# Altium schematic sheet pixhawk2.4.9.SchDoc
size 762 x 1016 mm
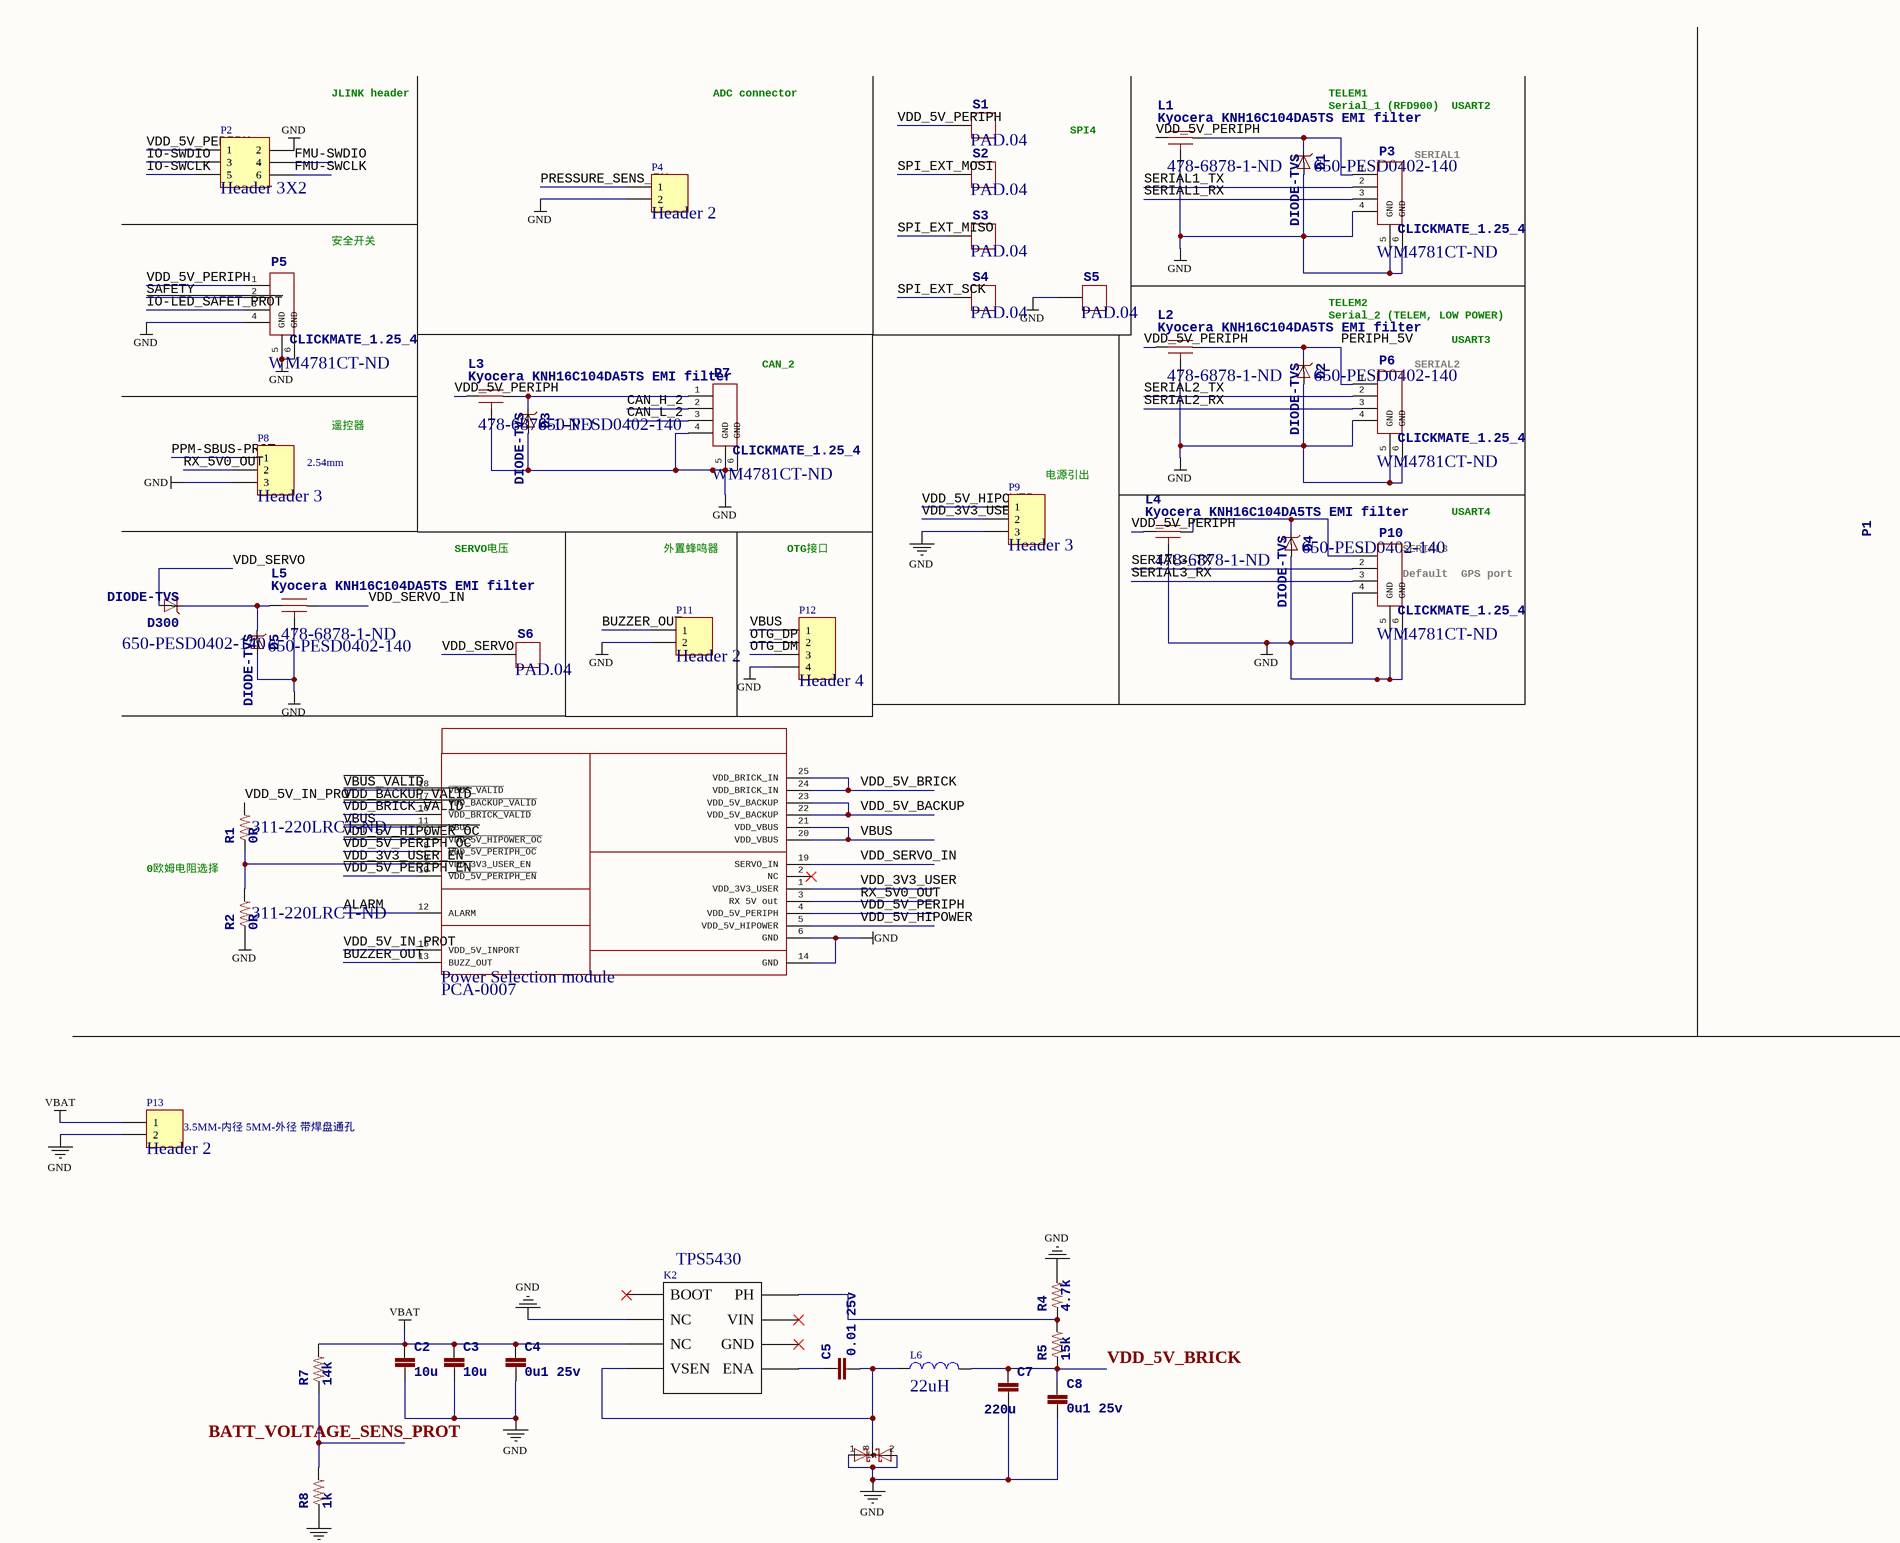
[diagram p0: pixhawk2.4.9.SchDoc, top left]
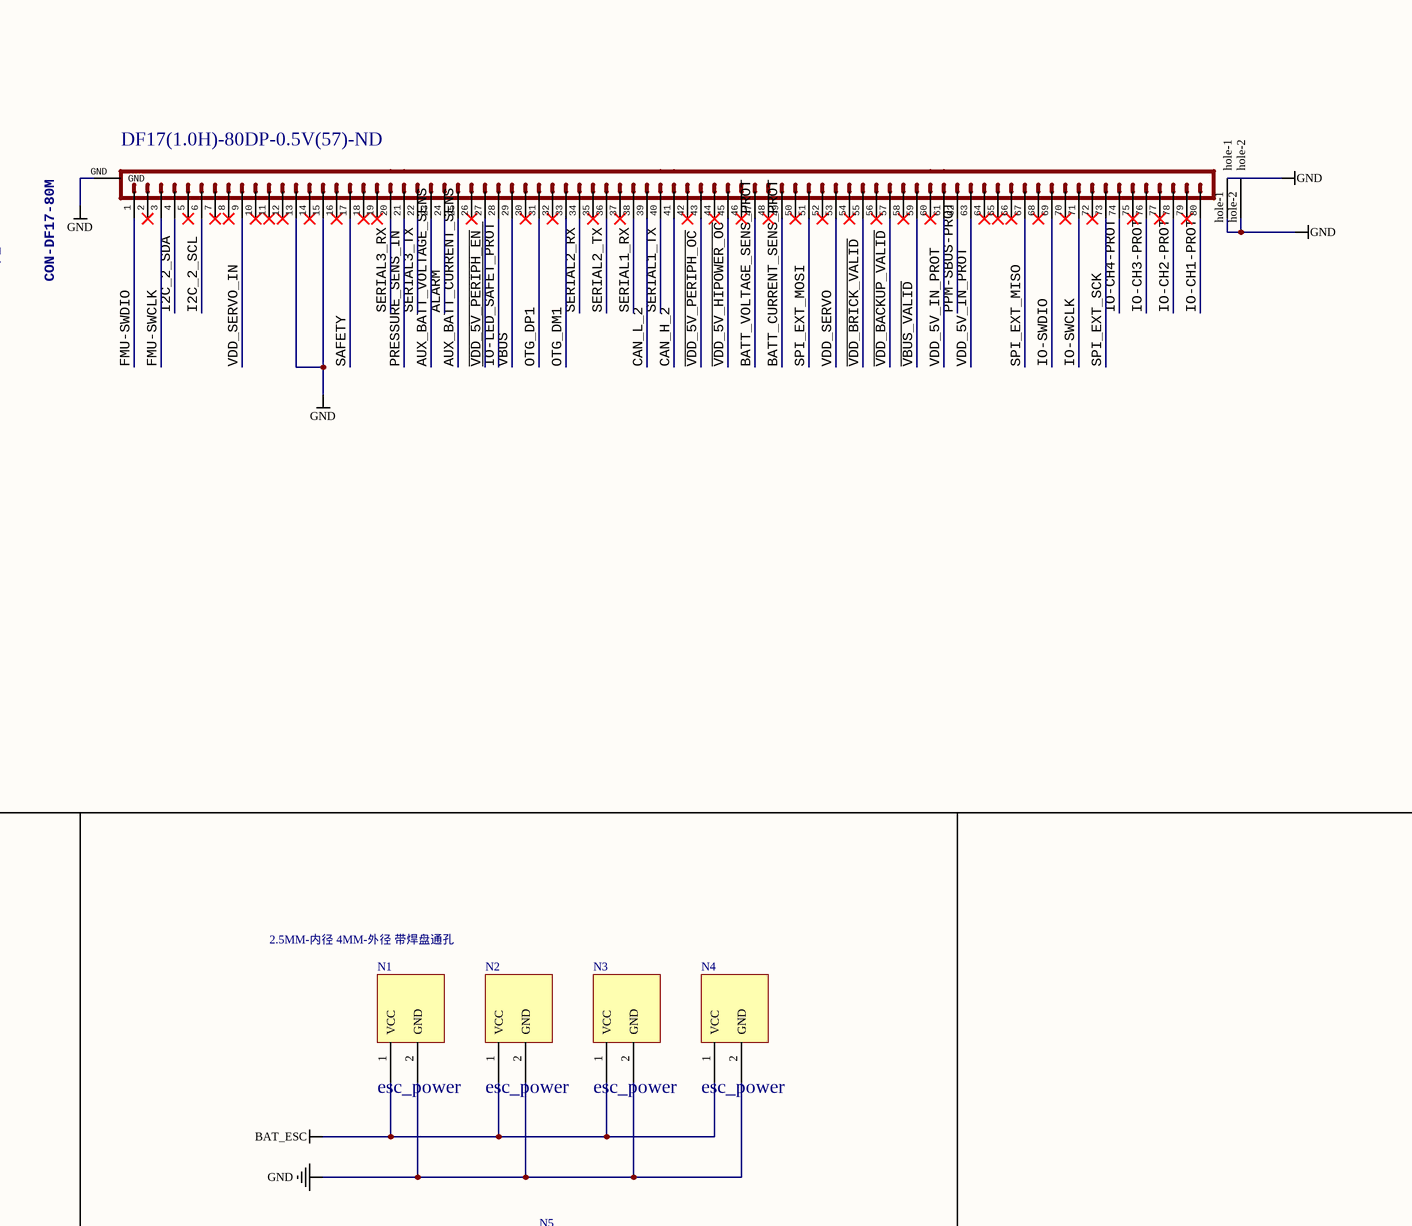
[diagram p1: pixhawk2.4.9.SchDoc, top right]
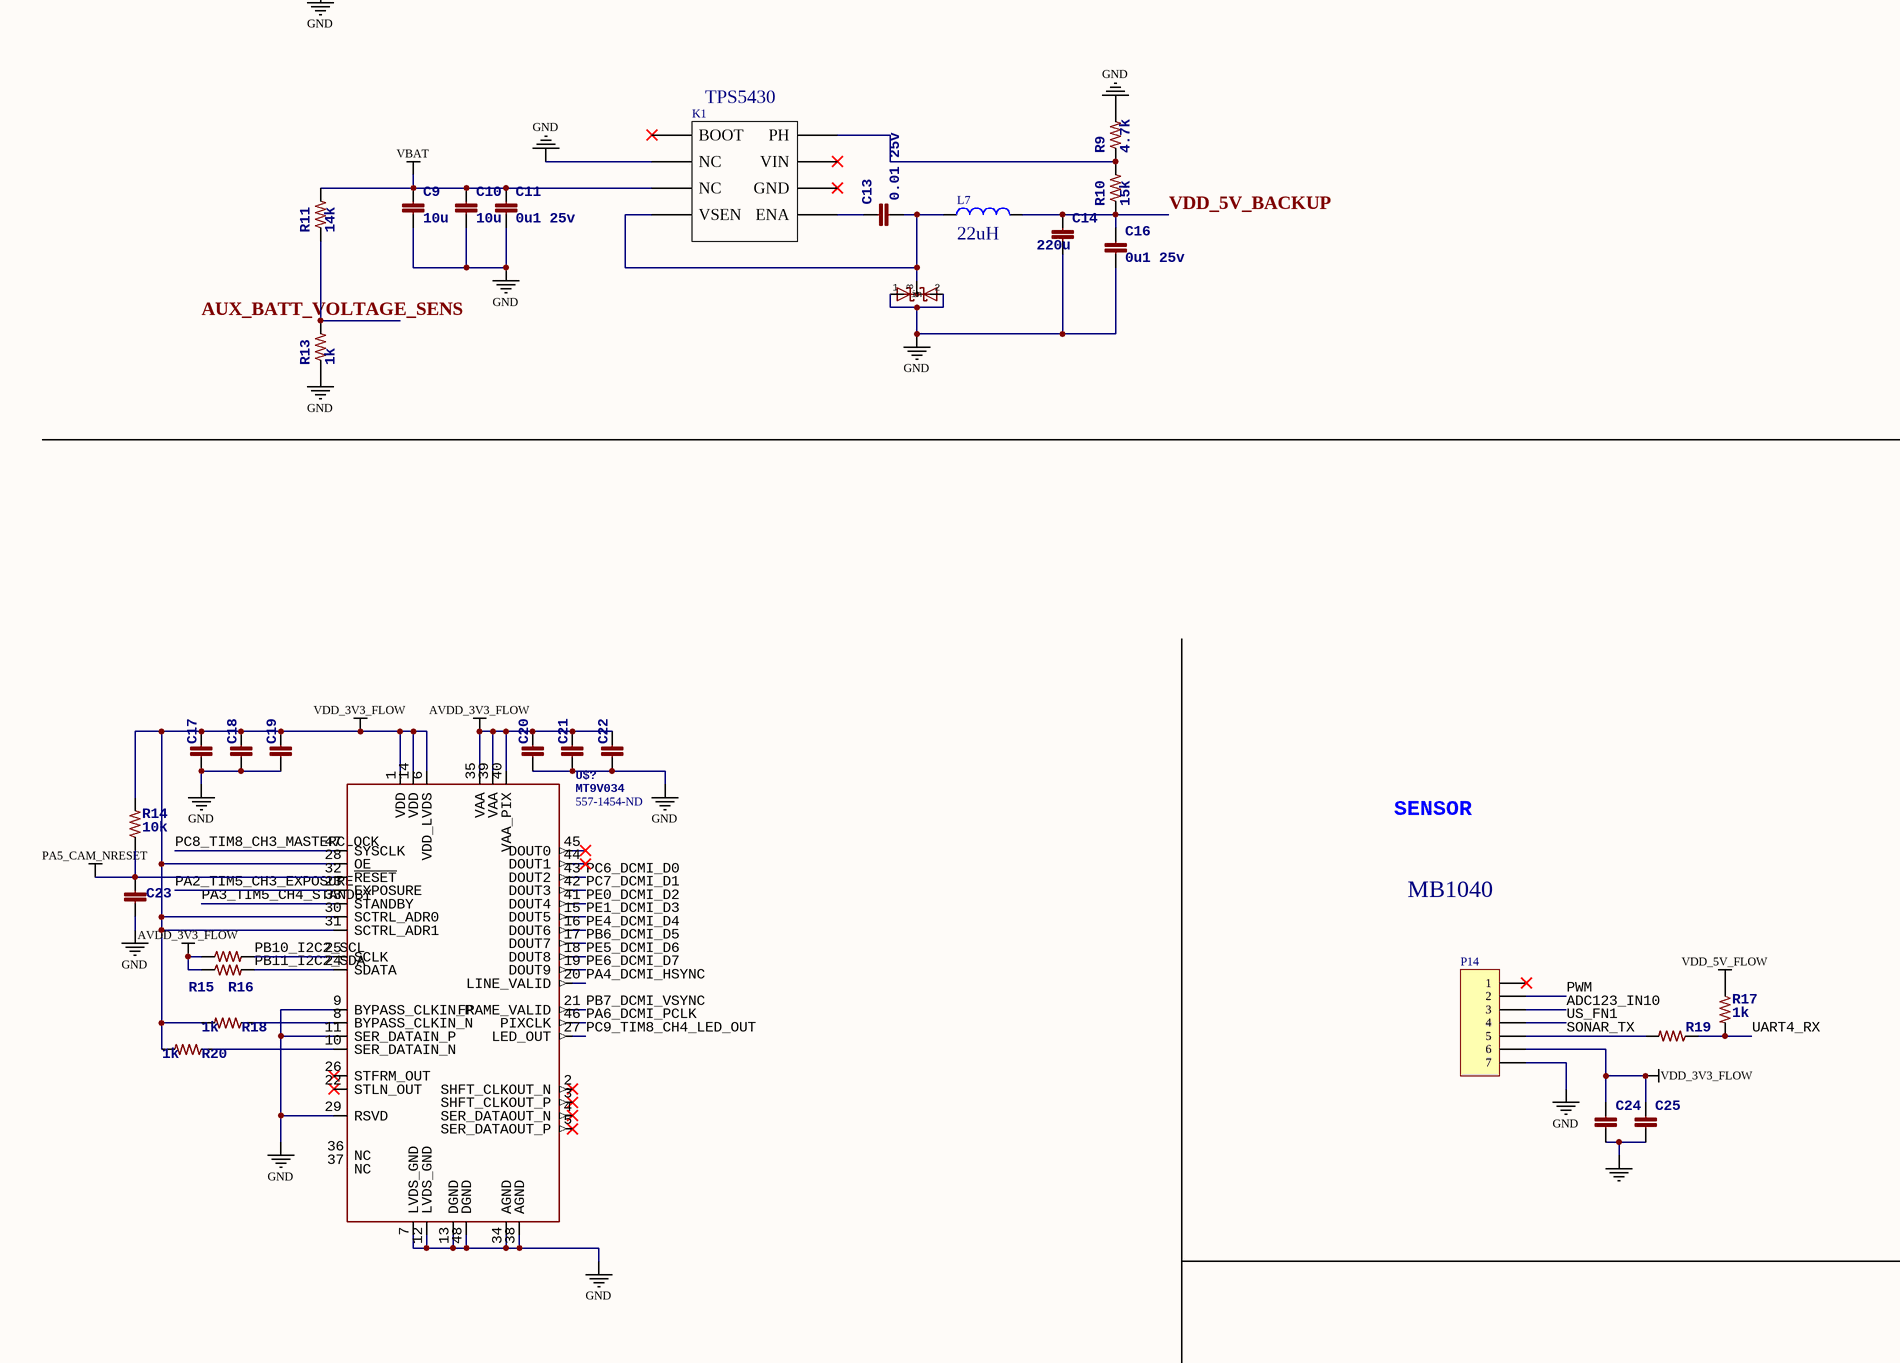
[diagram p2: pixhawk2.4.9.SchDoc, centre left]
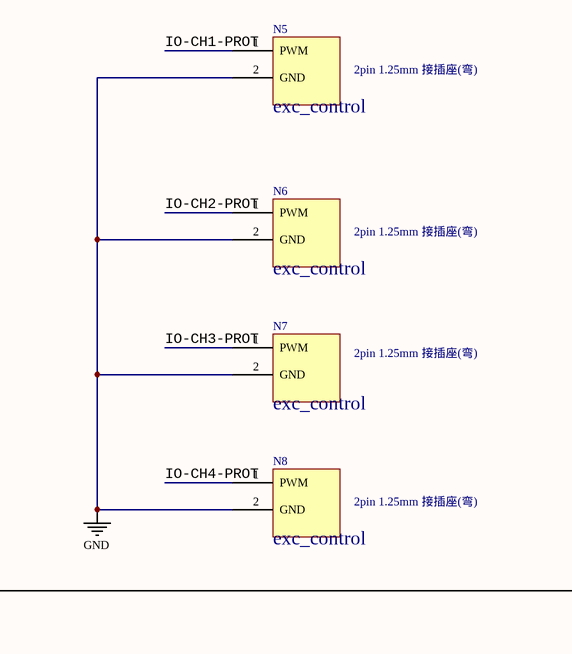
[diagram p3: pixhawk2.4.9.SchDoc, centre right]
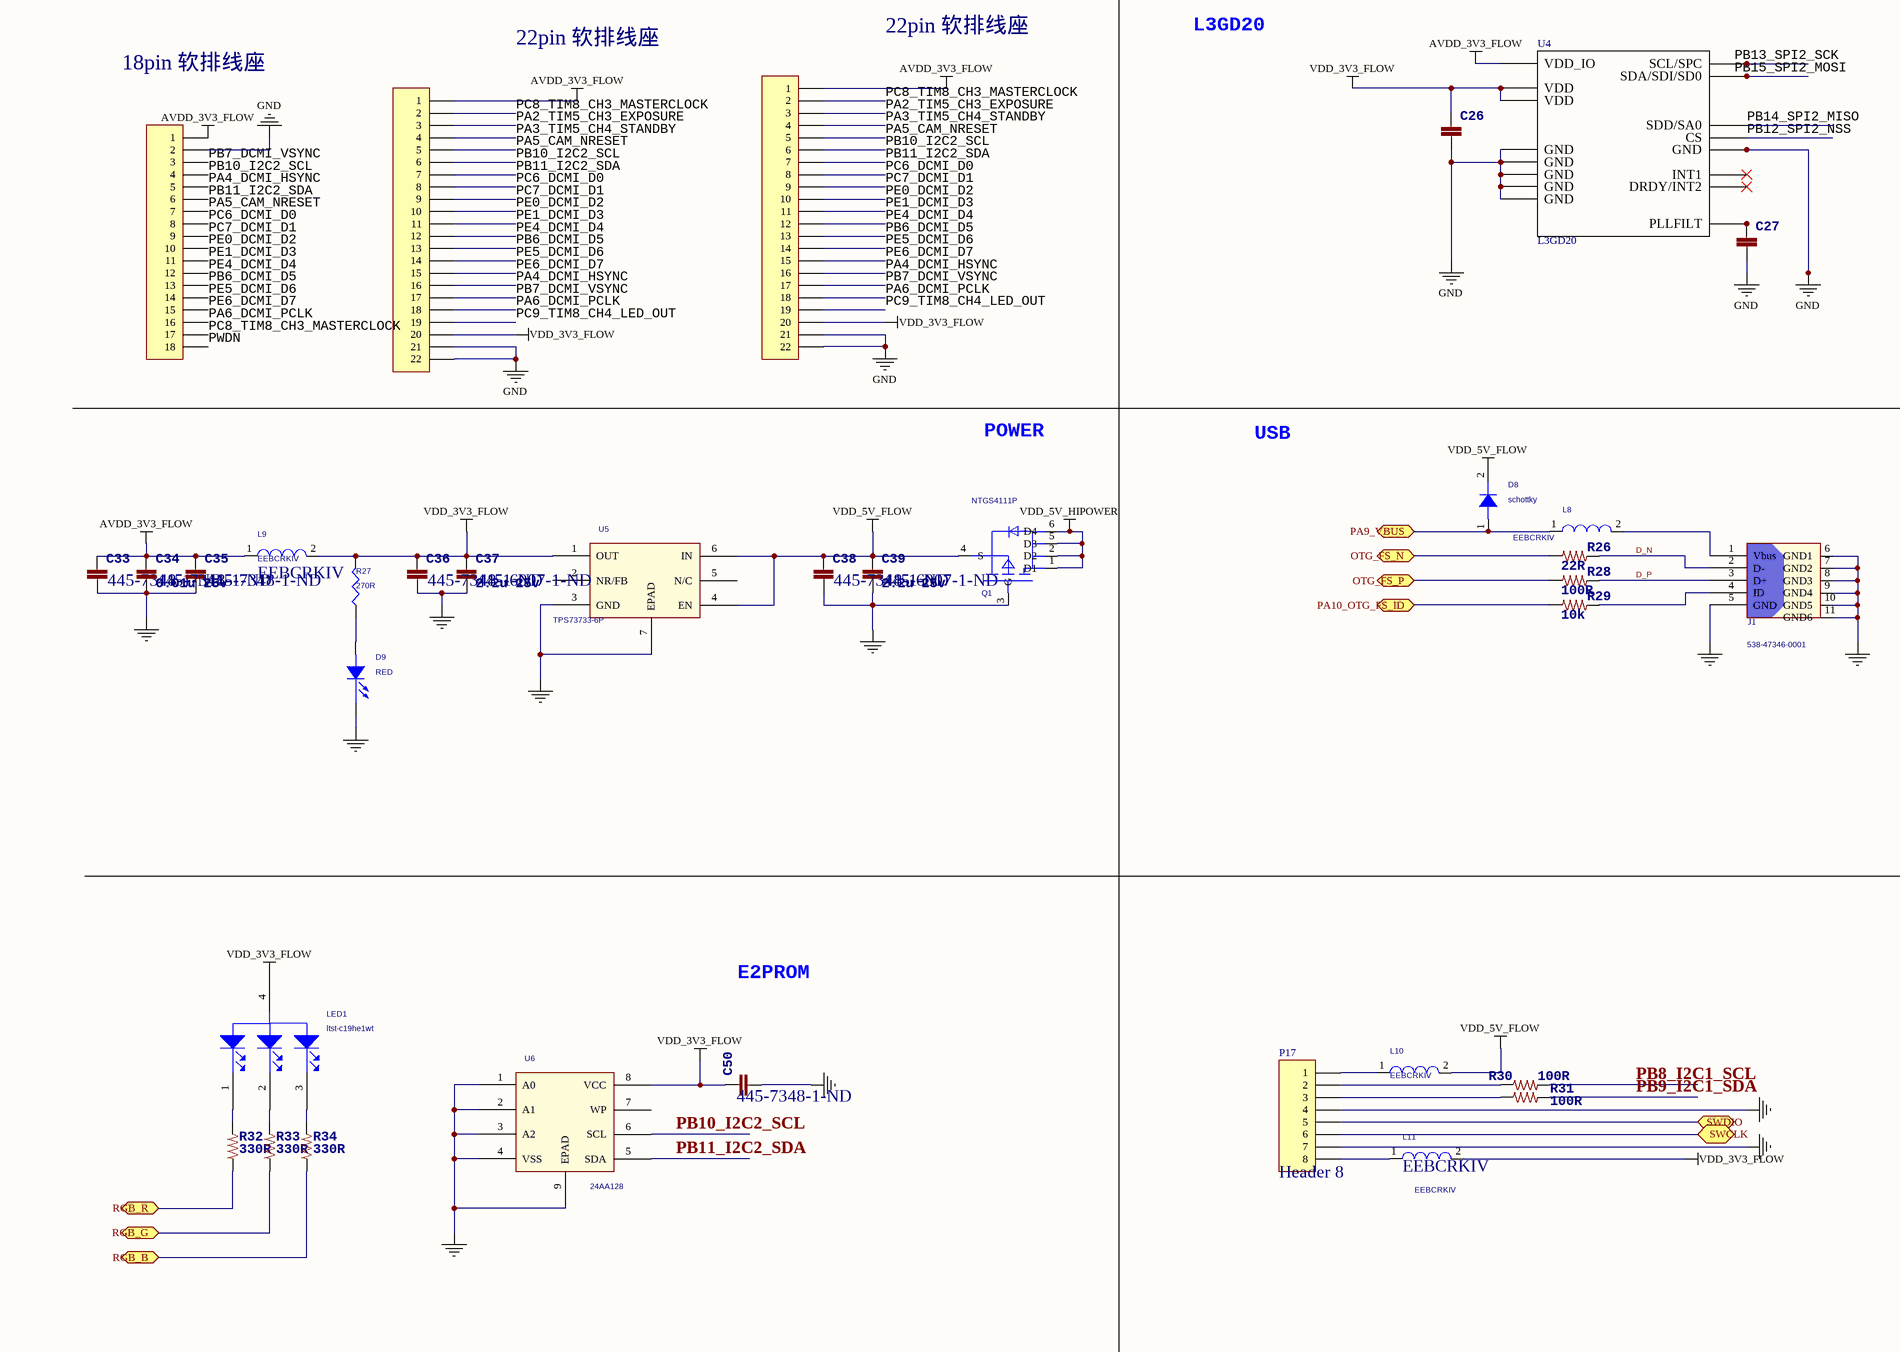
[diagram p4: pixhawk2.4.9.SchDoc, bottom left]
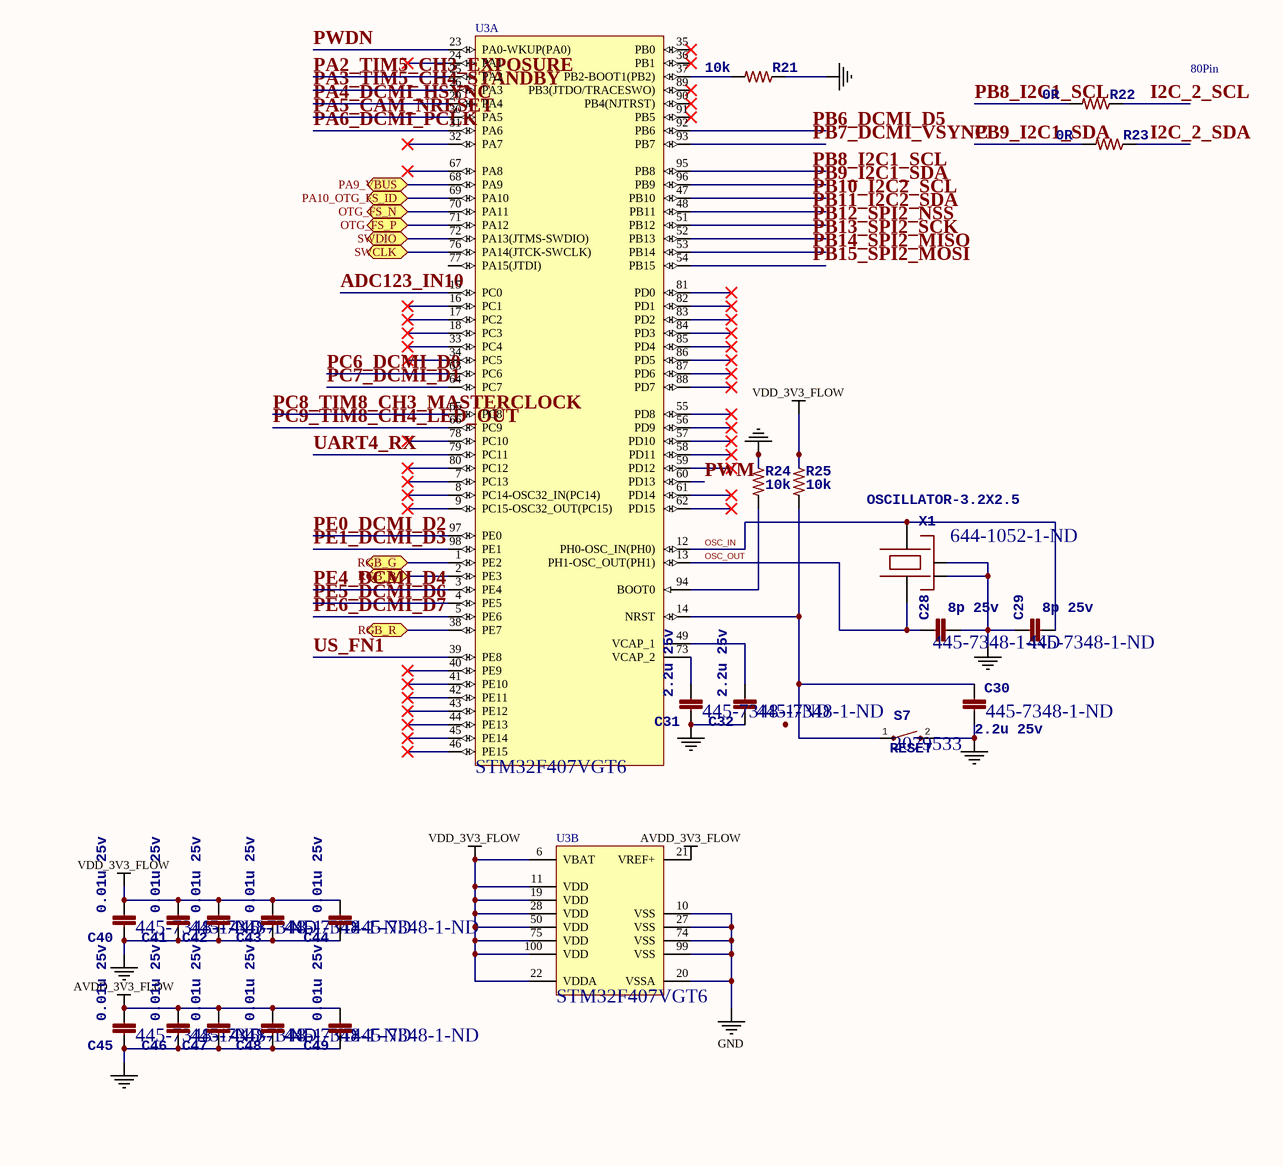
[diagram p5: pixhawk2.4.9.SchDoc, bottom right]

## Parts
C2  10u  [C1206]
C3  10u  [C1206]
C4  0u1 25v  [C0402]
C5  0.01 25v  [C0402]
C7  220u  [C1206]
C8  0u1 25v  [C0402]
C9  10u  [C1206]
C10  10u  [C1206]
C11  0u1 25v  [C0402]
C13  0.01 25v  [C0402]
C14  220u  [C1206]
C16  0u1 25v  [C0402]
C17  (no value)  [C0402]
C18  (no value)  [C0402]
C19  (no value)  [C0402]
C20  0.1u 25v  [C0402]  (value not drawn)
C21  (no value)  [C0402]
C22  (no value)  [C0402]
C23  (no value)  [C0402]
C24  0.01u 25v  [C0402]  (value not drawn)
C25  2.2u 25v  [C0402]  (value not drawn)
C26  (no value)  [C0402]
C27  0.01u 25v  [C0402]  (value not drawn)
C28  8p 25v  Supplier Part Number 1: 445-7348-1-ND  [C0402]
C29  8p 25v  Supplier Part Number 1: 445-7348-1-ND  [C0402]
C30  2.2u 25v  Supplier Part Number 1: 445-7348-1-ND  [C0402]
C31  2.2u 25v  Supplier Part Number 1: 445-7348-1-ND  [C0402]
C32  2.2u 25v  Supplier Part Number 1: 445-7348-1-ND  [C0402]
C33  Supplier Part Number 1: 445-7348-1-ND  [C0402]
C34  0.01u 25v  Supplier Part Number 1: 445-7348-1-ND  [C0402]
C35  Supplier Part Number 1: 445-7348-1-ND  [C0402]
C36  Supplier Part Number 1: 445-7348-1-ND  [C0402]
C37  2.2u 25v  Supplier Part Number 1: 445-6007-1-ND  [C1206]
C38  Supplier Part Number 1: 445-7348-1-ND  [C0402]
C39  2.2u 25v  Supplier Part Number 1: 445-6007-1-ND  [C1206]
C40  0.01u 25v  Supplier Part Number 1: 445-7348-1-ND  [C0402]
C41  0.01u 25v  Supplier Part Number 1: 445-7348-1-ND  [C0402]
C42  0.01u 25v  Supplier Part Number 1: 445-7348-1-ND  [C0402]
C43  0.01u 25v  Supplier Part Number 1: 445-7348-1-ND  [C0402]
C44  0.01u 25v  Supplier Part Number 1: 445-7348-1-ND  [C0402]
C45  0.01u 25v  Supplier Part Number 1: 445-7348-1-ND  [C0402]
C46  0.01u 25v  Supplier Part Number 1: 445-7348-1-ND  [C0402]
C47  0.01u 25v  Supplier Part Number 1: 445-7348-1-ND  [C0402]
C48  0.01u 25v  Supplier Part Number 1: 445-7348-1-ND  [C0402]
C49  0.01u 25v  Supplier Part Number 1: 445-7348-1-ND  [C0402]
C50  Supplier Part Number 1: 445-7348-1-ND  [C0402]
D1  DIODE-TVS  Supplier Part Number 1: 650-PESD0402-140  [0402-TVS]
D2  DIODE-TVS  Supplier Part Number 1: 650-PESD0402-140  [0402-TVS]
D3  DIODE-TVS  Supplier Part Number 1: 650-PESD0402-140  [0402-TVS]
D4  DIODE-TVS  Supplier Part Number 1: 650-PESD0402-140  [0402-TVS]
D5  DIODE-TVS  Supplier Part Number 1: 650-PESD0402-140  [0402-TVS]
D8  schottky  [D0603]
D9  RED  [LED0402]
D300  DIODE-TVS  Supplier Part Number 1: 650-PESD0402-140  [0402-TVS]
Da  (no value)  [TO-277A]
Db  (no value)  [TO-277A]
J1  Mouser Part Number: 538-47346-0001  [usbmicro_b]  (hidden comment: miniUSB)
K1  TPS5430
K2  TPS5430
L1  Kyocera KNH16C104DA5TS EMI filter  Supplier Part Number 1: 478-6878-1-ND  [KYOCERA-KNH16-DA]
L2  Kyocera KNH16C104DA5TS EMI filter  Supplier Part Number 1: 478-6878-1-ND  [KYOCERA-KNH16-DA]
L3  Kyocera KNH16C104DA5TS EMI filter  Supplier Part Number 1: 478-6878-1-ND  [KYOCERA-KNH16-DA]
L4  Kyocera KNH16C104DA5TS EMI filter  Supplier Part Number 1: 478-6878-1-ND  [KYOCERA-KNH16-DA]
L5  Kyocera KNH16C104DA5TS EMI filter  Supplier Part Number 1: 478-6878-1-ND  [KYOCERA-KNH16-DA]
L6  value 22uH  [CKCD5D28]  (hidden comment: Inductor)
L7  value 22uH  [CKCD5D28]  (hidden comment: Inductor)
L8  EEBCRKIV  [L0603]
L9  EEBCRKIV  [L0603]
L10  EEBCRKIV  [L0603]
L11  EEBCRKIV  [L0603]
LED1  ltst-c19he1wt  [ltst-c19he1wt]
N1  esc_power
N2  esc_power
N3  esc_power
N4  esc_power
N5  exc_control
N6  exc_control
N7  exc_control
N8  exc_control
P1  CON-DF17-80M  Supplier Part Number 1: DF17(1.0H)-80DP-0.5V(57)-ND  [CON-DF17-80M]
P2  Header 3X2  [HDR2X3]
P3  CLICKMATE_1.25_4  Supplier Part Number 1: WM4781CT-ND  [CLICKMATE_V4]
P4  Header 2  [HDR1X2]
P5  CLICKMATE_1.25_4  Supplier Part Number 1: WM4781CT-ND  [CLICKMATE_V4]
P6  CLICKMATE_1.25_4  Supplier Part Number 1: WM4781CT-ND  [CLICKMATE_V4]
P7  CLICKMATE_1.25_4  Supplier Part Number 1: WM4781CT-ND  [CLICKMATE_V4]
P8  Header 3  [HDR1X3]
P9  Header 3  [HDR1X3]
P10  CLICKMATE_1.25_4  Supplier Part Number 1: WM4781CT-ND  [CLICKMATE_V4]
P11  Header 2  [HDR1X2]
P12  Header 4  [HDR1X4]
P13  Header 2  [VBAT-JACK]
P14  Header 7  [HDR1X7]  (value not drawn)
P15  Header 18  [FPC-18_0P5]  (value not drawn)
P16  Header 22  [FPC-22_0P5]  (value not drawn)
P17  Header 8  [HDR1X8]
P18  Header 22  [FPC-22_0P5]  (value not drawn)
PSM1  Power Selection module  Supplier Part Number 1: PCA-0007  [PSM]
Q1  NTGS4111P  [TSOP-6]
R1  0R  Supplier Part Number 1: 311-220LRCT-ND  [R0402]
R2  0R  Supplier Part Number 1: 311-220LRCT-ND  [R0402]
R4  4.7k  [R0402]
R5  15k  [R0402]
R7  14k  [R0402]
R8  1k  [R0402]
R9  4.7k  [R0402]
R10  15k  [R0402]
R11  14k  [R0402]
R13  1k  [R0402]
R14  10k  [R0402]
R15  330R  [R0402]  (value not drawn)
R16  330R  [R0402]  (value not drawn)
R17  1k  [R0402]
R18  1k  [R0402]
R19  0R  [R0402]  (value not drawn)
R20  1k  [R0402]
R21  10k  [R0402]
R22  0R  [R0402]
R23  0R  [R0402]
R24  10k  [R0402]
R25  10k  [R0402]
R26  22R  [R0402]
R27  270R  [R0201]
R28  100R  [R0402]
R29  10k  [R0402]
R30  100R  [R0402]
R31  100R  [R0402]
R32  330R  [R0402]
R33  330R  [R0402]
R34  330R  [R0402]
S1  PAD.04  [PAD_04X04]
S2  PAD.04  [PAD_04X04]
S3  PAD.04  [PAD_04X04]
S4  PAD.04  [PAD_04X04]
S5  PAD.04  [PAD_04X04]
S6  PAD.04  [PAD_04X04]
S7  RESET  Supplier Part Number 1: 2079533  [EVQP7J01K]
U3  STM32F407VGT6  [STM-LQFP100_N]  (parts A,B of 2)
U4  L3GD20
U5  TPS73733-6P  [S-PDSO-N6]
U6  24AA128  [TDFN-8]
U$?  MT9V034  Supplier Part Number 1: 557-1454-ND  [CLCC-48]
X1  OSCILLATOR-3.2X2.5  Supplier Part Number 1: 644-1052-1-ND  [3225SA]

## Ports
OTG_FS_N (bidir), OTG_FS_P (bidir), PA9_VBUS (bidir), PA10_OTG_FS_ID (bidir), RGB_B (bidir), RGB_G (bidir), RGB_R (bidir), SWCLK (bidir), SWDIO (bidir)

## Nets
AVDD_3V3_FLOW: C20.1 C21.1 C22.1 C33.P$1 C34.P$1 C35.P$1 C45.P$2 C46.P$2 C47.P$2 C48.P$2 C49.P$2 L9.1 P15.1 P16.1 P18.1 R15.1 R16.1 U3.21(VREF+) U4.1(VDD_IO) U$?.35(VAA) U$?.39(VAA) U$?.40(VAA_PIX)
BAT_ESC: N1.1(VCC) N2.1(VCC) N3.1(VCC) N4.1(VCC)
GND: C2.P$2 C3.P$2 C4.P$2 C7.P$2 C8.P$2 C9.P$2 C10.P$2 C11.P$2 C14.P$2 C16.P$2 C17.2 C18.2 C19.2 C20.2 C21.2 C22.2 C23.2 C24.P$2 C25.P$2 C26.P$2 C27.P$2 C28.P$2 C29.P$1 C30.P$2 C31.P$1 C32.P$1 C33.P$2 C34.P$2 C35.P$2 C36.P$2 C37.P$2 C38.P$2 C39.P$2 C40.P$1 C41.P$1 C42.P$1 C43.P$1 C44.P$1 C45.P$1 C46.P$1 C47.P$1 C48.P$1 C49.P$1 C50.P$2 D1.A D2.A D3.A D4.A D5.A D9.2(CATHODE) Da.1(in) Da.2(in) Db.1(in) Db.2(in) J1.5(GND) J1.6(GND1) J1.7(GND2) J1.8(GND3) J1.9(GND4) J1.10(GND5) J1.11(GND6) K1.2(NC) K2.2(NC) L1.GND L2.GND L3.GND L4.GND L5.GND N1.2(GND) N2.2(GND) N3.2(GND) N4.2(GND) N5.2(GND) N6.2(GND) N7.2(GND) N8.2(GND) P1.13 P1.15 P1.GND P1.hole-1 P1.hole-2 P2.2 P3.4 P3.5(GND) P3.6(GND) P4.2 P5.4 P5.5(GND) P5.6(GND) P6.4 P6.5(GND) P6.6(GND) P7.4 P7.5(GND) P7.6(GND) P8.3 P9.3 P10.4 P10.5(GND) P10.6(GND) P11.2 P12.4 P13.2 P14.7 P15.2 P16.21 P16.22 P17.4 P17.7 P18.21 P18.22 PSM1.6(GND) PSM1.14(GND) Q1.3(G) R2.P$1 R4.P$2 R8.P$1 R9.P$2 R13.P$1 R21.1 R24.1 S5.P$1 S7.2 U3.10(VSS) U3.20(VSSA) U3.27(VSS) U3.74(VSS) U3.99(VSS) U4.8(GND) U4.9(GND) U4.10(GND) U4.11(GND) U4.12(GND) U4.13(GND) U5.3(GND) U5.7(EPAD) U6.1(A0) U6.2(A1) U6.3(A2) U6.4(VSS) U6.9(EPAD) U$?.7(LVDS_GND) U$?.9(BYPASS_CLKIN_P) U$?.11(SER_DATAIN_P) U$?.12(LVDS_GND) U$?.13(DGND) U$?.29(RSVD) U$?.34(AGND) U$?.38(AGND) U$?.48(DGND) X1.2(NC_2) X1.4(NC_4)
PA5_CAM_NRESET: C23.1 P15.7 P16.5 P18.5 R14.1 U3.30(PA5) U$?.32(~{RESET})
VBAT: C2.P$1 C3.P$1 C4.P$1 C9.P$1 C10.P$1 C11.P$1 K1.3(NC) K2.3(NC) P13.1 R7.P$2 R11.P$2
VDD_3V3_FLOW: C17.1 C18.1 C19.1 C24.P$1 C25.P$1 C26.P$1 C36.P$1 C37.P$1 C40.P$2 C41.P$2 C42.P$2 C43.P$2 C44.P$2 C50.P$1 L9.2 L11.2 LED1.4(Polarity+) P14.6 P16.20 P18.20 R14.2 R18.2 R20.2 R25.1 R27.2 U3.6(VBAT) U3.11(VDD) U3.19(VDD) U3.22(VDDA) U3.28(VDD) U3.50(VDD) U3.75(VDD) U3.100(VDD) U4.15(VDD) U5.1(OUT) U6.8(VCC) U$?.1(VDD) U$?.6(VDD_LVDS) U$?.14(VDD) U$?.28(OE) U$?.30(SCTRL_ADR0) U$?.31(SCTRL_ADR1)
VDD_5V_FLOW: C38.P$1 C39.P$1 D8.2(C) L10.2 Q1.4(S) R17.1 U5.4(EN) U5.6(IN)
VDD_5V_HIPOWER: P9.1 PSM1.5(VDD_5V_HIPOWER) Q1.1(D1) Q1.2(D2) Q1.5(D3) Q1.6(D4)
ADC123_IN10: P14.3 U3.15(PC0)
ALARM: P1.24 PSM1.12(ALARM)
AUX_BATT_CURRENT_SENS: P1.25
AUX_BATT_VOLTAGE_SENS: P1.23
BATT_CURRENT_SENS_PROT: P1.49
BATT_VOLTAGE_SENS_PROT: P1.47
BUZZER_OUT: P11.1 PSM1.13(BUZZ_OUT)
CAN_H_2: P1.41 P7.2
CAN_L_2: P1.39 P7.3
D_N: J1.2(D-) R26.2
D_P: J1.3(D+) R28.2
FMU-SWCLK: P1.3 P2.6
FMU-SWDIO: P1.1 P2.4
I2C_2_SCL: P1.6 R22.1
I2C_2_SDA: P1.4 R23.1
~{IO-LED_SAFET_PROT}: P1.28 P5.3
IO-CH1-PROT: N5.1(PWM) P1.80
IO-CH2-PROT: N6.1(PWM) P1.78
IO-CH3-PROT: N7.1(PWM) P1.76
IO-CH4-PROT: N8.1(PWM) P1.74
IO-SWCLK: P1.71 P2.5
IO-SWDIO: P1.69 P2.3
OSC_IN: C29.P$2 U3.12(PH0-OSC_IN(PH0)) X1.3
OSC_OUT: C28.P$1 U3.13(PH1-OSC_OUT(PH1)) X1.1
OTG_DM1: P1.33 P12.3
OTG_DP1: P1.31 P12.2
OTG_FS_N: R26.1 U3.70(PA11) ; port OTG_FS_N
OTG_FS_P: R28.1 U3.71(PA12) ; port OTG_FS_P
PA2_TIM5_CH3_EXPOSURE: P16.3 P18.3 U3.25(PA2) U$?.23(EXPOSURE)
PA3_TIM5_CH4_STANDBY: P16.4 P18.4 U3.26(PA3) U$?.33(STANDBY)
PA4_DCMI_HSYNC: P15.5 P16.16 P18.16 U3.29(PA4) U$?.20(LINE_VALID)
PA6_DCMI_PCLK: P15.16 P16.18 P18.18 U3.31(PA6) U$?.46(PIXCLK)
PA9_VBUS: D8.1(A) L8.1 U3.68(PA9) ; port PA9_VBUS
PA10_OTG_FS_ID: R29.1 U3.69(PA10) ; port PA10_OTG_FS_ID
PB6_DCMI_D5: P15.13 P16.13 P18.13 U3.92(PB6) U$?.17(DOUT7)
PB7_DCMI_VSYNC: P15.3 P16.17 P18.17 U3.93(PB7) U$?.21(FRAME_VALID)
PB8_I2C1_SCL: R22.2 R30.2 U3.95(PB8)
PB9_I2C1_SDA: R23.2 R31.2 U3.96(PB9)
PB10_I2C2_SCL: P15.4 P16.6 P18.6 R15.2 U3.47(PB10) U6.6(SCL) U$?.25(SCLK)
PB11_I2C2_SDA: P15.6 P16.7 P18.7 R16.2 U3.48(PB11) U6.5(SDA) U$?.24(SDATA)
PB12_SPI2_NSS: U3.51(PB12) U4.5(CS)
PB13_SPI2_SCK: U3.52(PB13) U4.2(SCL/SPC)
PB14_SPI2_MISO: U3.53(PB14) U4.4(SDD/SA0)
PB15_SPI2_MOSI: U3.54(PB15) U4.3(SDA/SDI/SD0)
PC6_DCMI_D0: P15.8 P16.8 P18.8 U3.63(PC6) U$?.43(DOUT2)
PC7_DCMI_D1: P15.9 P16.9 P18.9 U3.64(PC7) U$?.42(DOUT3)
PC8_TIM8_CH3_MASTERCLOCK: P15.17 P16.2 P18.2 U3.65(PC8) U$?.47(SYSCLK)
PC9_TIM8_CH4_LED_OUT: P16.19 P18.19 U3.66(PC9) U$?.27(LED_OUT)
PE0_DCMI_D2: P15.10 P16.10 P18.10 U3.97(PE0) U$?.41(DOUT4)
PE1_DCMI_D3: P15.11 P16.11 P18.11 U3.98(PE1) U$?.15(DOUT5)
PE4_DCMI_D4: P15.12 P16.12 P18.12 U3.3(PE4) U$?.16(DOUT6)
PE5_DCMI_D6: P15.14 P16.14 P18.14 U3.4(PE5) U$?.18(DOUT8)
PE6_DCMI_D7: P15.15 P16.15 P18.15 U3.5(PE6) U$?.19(DOUT9)
PERIPH_5V: D2.C L2.P$2 P6.1
PPM-SBUS-PROT: P1.62 P8.1
PRESSURE_SENS_IN: P1.21 P4.1
PWDN: P15.18 U3.23(PA0-WKUP(PA0))
PWM: P14.2 U3.60(PD13)
RGB_B: R34.2 U3.2(PE3) ; port RGB_B
RGB_G: R33.2 U3.1(PE2) ; port RGB_G
RGB_R: R32.2 U3.38(PE7) ; port RGB_R
RX_5V0_OUT: P8.2 PSM1.3(RX_5V_out)
SAFETY: P1.17 P5.2
SERIAL1_RX: P1.38 P3.3
SERIAL1_TX: P1.40 P3.2
SERIAL2_RX: P1.34 P6.3
SERIAL2_TX: P1.36 P6.2
SERIAL3_RX: P1.20 P10.3
SERIAL3_TX: P1.22 P10.2
SONAR_TX: P14.5 R19.2
SPI_EXT_MISO: P1.67 S3.P$1
SPI_EXT_MOSI: P1.51 S2.P$1
SPI_EXT_SCK: P1.73 S4.P$1
SWCLK: P17.6 U3.76(PA14(JTCK-SWCLK)) ; port SWCLK
SWDIO: P17.5 U3.72(PA13(JTMS-SWDIO)) ; port SWDIO
UART4_RX: R17.2 R19.1 U3.79(PC11)
US_FN1: P14.4 U3.39(PE8)
~{VBUS_VALID}: P1.59 PSM1.18(~{VBUS_VALID})
~{VDD_5V_HIPOWER_OC}: P1.45 PSM1.7(~{VDD_5V_HIPOWER_OC})
~{VDD_5V_PERIPH_EN}: P1.27 PSM1.10(~{VDD_5V_PERIPH_EN})
~{VDD_5V_PERIPH_OC}: P1.43 PSM1.8(~{VDD_5V_PERIPH_OC})
~{VDD_BACKUP_VALID}: P1.57 PSM1.17(~{VDD_BACKUP_VALID})
~{VDD_BRICK_VALID}: P1.55 PSM1.16(~{VDD_BRICK_VALID})
VBUS: P1.29 P12.1 PSM1.11(VBUS) PSM1.20(VDD_VBUS) PSM1.21(VDD_VBUS)
VDD_3V3_USER: P9.2 PSM1.1(VDD_3V3_USER)
VDD_3V3_USER_EN: PSM1.9(VDD_3V3_USER_EN) R1.P$1 R2.P$2
VDD_5V_BACKUP: C14.P$1 C16.P$1 L7.2 PSM1.22(VDD_5V_BACKUP) PSM1.23(VDD_5V_BACKUP) R10.P$1
VDD_5V_BRICK: C7.P$1 C8.P$1 L6.2 PSM1.24(VDD_BRICK_IN) PSM1.25(VDD_BRICK_IN) R5.P$1
VDD_5V_IN_PROT: P1.61 P1.63 PSM1.15(VDD_5V_INPORT) R1.P$2
VDD_5V_PERIPH: L1.P$1 L2.P$1 L3.P$1 L4.P$1 P2.1 P5.1 PSM1.4(VDD_5V_PERIPH) S1.P$1
VDD_SERVO: D300.A P1.53 S6.P$1
VDD_SERVO_IN: L5.P$2 P1.9 PSM1.19(SERVO_IN)
NetC5_P$1: C5.P$1 K2.5(ENA)
NetC5_P$2: C5.P$2 Da.3(out) K2.4(VSEN) L6.1
NetC13_P$1: C13.P$1 K1.5(ENA)
NetC13_P$2: C13.P$2 Db.3(out) K1.4(VSEN) L7.1
NetC27_P$1: C27.P$1 U4.14(PLLFILT)
NetC30_P$1: C30.P$1 R25.2 S7.1 U3.14(NRST)
NetC31_P$2: C31.P$2 U3.73(VCAP_2)
NetC32_P$2: C32.P$2 U3.49(VCAP_1)
NetD1_C: D1.C L1.P$2 P3.1
NetD3_C: D3.C L3.P$2 P7.1
NetD4_C: D4.C L4.P$2 P10.1
NetD5_C: D5.C D300.C L5.P$1
NetD9_1: D9.1(ANODE) R27.1
NetJ1_1: J1.1(Vbus) L8.2
NetJ1_4: J1.4(ID) R29.2
NetK1_8: K1.8(PH) R9.P$1 R10.P$2
NetK2_8: K2.8(PH) R4.P$1 R5.P$2
NetL10_1: L10.1 P17.1
NetL11_1: L11.1 P17.8
NetLED1_1: LED1.1(R) R32.1
NetLED1_2: LED1.2(G) R33.1
NetLED1_3: LED1.3(B) R34.1
NetP17_2: P17.2 R30.1
NetP17_3: P17.3 R31.1
NetR7_P$1: R7.P$1 R8.P$2
NetR11_P$1: R11.P$1 R13.P$2
NetR18_1: R18.1 U$?.8(BYPASS_CLKIN_N)
NetR20_1: R20.1 U$?.10(SER_DATAIN_N)
NetR21_2: R21.2 U3.37(PB2-BOOT1(PB2))
NetR24_2: R24.2 U3.94(BOOT0)

Not connected (* = marked no-connect by the designer): K1 1(BOOT)* 6(GND)* 7(VIN)*; K2 1(BOOT)* 6(GND)* 7(VIN)*; P1 2* 5* 7* 8* 10* 11* 12* 14* 16* 18* 19* 26* 30* 32* 35* 37* 42* 44* 46* 48* 50* 52* 54* 56* 58* 60* 64* 65* 66* 68* 70* 72* 75* 77* 79*; P14 1*; PSM1 2(NC)*; U3 7(PC13)* 8(PC14-OSC32_IN(PC14))* 9(PC15-OSC32_OUT(PC15))* 16(PC1)* 17(PC2)* 18(PC3)* 24(PA1)* 32(PA7)* 33(PC4)* 34(PC5)* 35(PB0)* 36(PB1)* 40(PE9)* 41(PE10)* 42(PE11)* 43(PE12)* 44(PE13)* 45(PE14)* 46(PE15)* 55(PD8)* 56(PD9)* 57(PD10)* 58(PD11)* 59(PD12)* 61(PD14)* 62(PD15)* 67(PA8)* 77(PA15(JTDI)) 78(PC10)* 80(PC12)* 81(PD0)* 82(PD1)* 83(PD2)* 84(PD3)* 85(PD4)* 86(PD5)* 87(PD6)* 88(PD7)* 89(PB3(JTDO/TRACESWO))* 90(PB4(NJTRST))* 91(PB5)*; U4 6(DRDY/INT2)* 7(INT1)*; U5 2(NR/FB) 5(N/C); U6 7(WP); U$? 2(SHFT_CLKOUT_N)* 3(SHFT_CLKOUT_P)* 4(SER_DATAOUT_N)* 5(SER_DATAOUT_P)* 22(STLN_OUT)* 26(STFRM_OUT)* 36(NC) 37(NC) 44(DOUT1)* 45(DOUT0)*

## Notes on the sheet
- JLINK header
- ADC connector
- TELEM1
- SPI4
- Serial_1 (RFD900)
- (near P3) SERIAL1
- USART2
- 安全开关
- Serial_2 (TELEM, LOW POWER)
- TELEM2
- USART3
- (near P7) CAN_2
- (near P6) SERIAL2
- 2.54mm
- 遥控器
- (near P9) 电源引出
- USART4
- SERVO电压
- 外置蜂鸣器
- OTG接口
- (near P10) SERIAL3
- (near P10) Default
  GPS port
- 0欧姆电阻选择
- (near P13) 3.5MM-内径 5MM-外径 带焊盘通孔
- 2.5MM-内径 4MM-外径 带焊盘通孔
- 2pin 1.25mm 接插座(弯)
- SENSOR
- MB1040
- 80Pin
- 18pin 软排线座
- 22pin 软排线座
- L3GD20
- POWER
- USB
- E2PROM
- Labels drawn without touching a wire or pin: AUX_BATT_VOLTAGE_SENS, BATT_VOLTAGE_SENS_PROT

## Library data of the parts
C2 C3 C9 C10 = CAP1206: CAP CER 10UF 50V 20% X5R 1206; PARTNO: C3216X5R1A107M160AC; 3DR_PARTNO: ECM0716; Value: 100U; Supplier 1: Digi-Key
C4 C8 C11 C16 = CAP0402: CAP CER 0.1UF 25V 10% X7R 0402; PARTNO: C1005X7R1E104K050BB; 3DR_PARTNO: ECM0701; Supplier 1: Digi-Key; Value: 0U1
C5 C13 C24 C27 C34 = CAP0402: CAP CER 0.01UF 25V 10% X7R 0402; PARTNO: C1005X7R1E104K050BB; 3DR_PARTNO: ECM0701; Value: 0U1; Supplier 1: Digi-Key
C7 C14 = CAP1206: CAP CER 220UF 50V 20% X5R 1206; PARTNO: C3216X5R1A107M160AC; 3DR_PARTNO: ECM0716; Value: 100U; Supplier 1: Digi-Key
C17-C23 = CAP0402-CAP: CAP CER 0.1UF 25V 10% X7R 0402; PARTNO: CC0402ZRY5V7BB104; Supplier 1: Digi-Key
C25 C30-C32 = CAP0402: CAP CER 2.2UF 25V 10% X7R 0402; PARTNO: C1005X7R1E104K050BB; 3DR_PARTNO: ECM0701; Value: 0U1; Supplier 1: Digi-Key
C26 C33 C35 C36 C38 C50 = CAP0402: CAP CER 0.1UF 25V 10% X7R 0402; PARTNO: C1005X7R1E104K050BB; 3DR_PARTNO: ECM0701; Value: 0U1; Supplier 1: Digi-Key
C28 = CAP0402: CAP CER 8pF 25V 10% X7R 0402; PARTNO: C1005X7R1E104K050BB; 3DR_PARTNO: ECM0701; Value: 0U1; Supplier 1: Digi-Key
C29 = CAP0402: CAP CER 8pf 25V 10% X7R 0402; PARTNO: C1005X7R1E104K050BB; 3DR_PARTNO: ECM0701; Value: 0U1; Supplier 1: Digi-Key
C37 C39 = CAP1206: CAP CER 2.2UF 25V 20% X5R 1206; PARTNO: C3216X5R1A107M160AC; 3DR_PARTNO: ECM0716; Value: 100U; Supplier 1: Digi-Key
C40-C49 = CAP0402: CAP CER 0.01u 25V 10% X7R 0402; PARTNO: C1005X7R1E104K050BB; 3DR_PARTNO: ECM0701; Value: 0U1; Supplier 1: Digi-Key
D1-D5 D300 = DIODE-TVS: Diode, TVS, 14VWM, 40VC, 0402, SMD; 3DR_PARTNO: ECM0837; Supplier 1: Mouser
D8 = DIODE_CA_0
D9 = LED_0
Da Db = TO-227A
J1 = MicroUSB_6
L1-L5 = KNH16C104DA5TS: Capacitor, Filter, 0.1uF, 25V, 2A, 0603, SMD; 3DR_PARTNO: ECM0719; Supplier 1: Digi-Key
L6 L7 = Inductor: Code_IEC: 1005; Published: 8-Jun-2000; LatestRevisionDate: 29-May-2009; LatestRevisionNote: IPC-7351 Footprint Added.; PackageReference: 0402-A; Publisher: Altium Limited; PackageDescription: Chip Inductor; Code_JEITA: 0402
L8-L11 = L: PSpiceTemplate: L^@REFDES %1 %2 ?TOLERANCE|L^@REFDES| @VALUE ?IC/IC=@IC/ ?TOLERANCE|\n.model l^@REFDES IND L=1 DEV=@TOLERANCE%|
  L9 L11: Value: EEBCRKIV
LED1 = LTST-C19HE1WT_0
P1 = CON-DF17-80M: Connector, Header, 80Pos, .5MM, DUAL, SMD, Au; 3DR_PARTNO: PRT0436; Supplier 1: Digi-Key
P2 = Header 3X2: Header, 3-Pin, Dual row; LatestRevisionDate: 17-Jul-2002; LatestRevisionNote: Re-released for DXP Platform.; Publisher: Altium Limited
P3 P5-P7 P10 = CLICKMATE_1.25_4: Connector, Rcpt, 4Pos, 1.25MM, W/B, VERT, SMD, Tin; 3DR_PARTNO: PRT0441; Supplier 1: Digi-Key
P4 P11 = Header 2: Header, 2-Pin; LatestRevisionDate: 17-Jul-2002; LatestRevisionNote: Re-released for DXP Platform.; Publisher: Altium Limited
P8 P9 = Header 3: Header, 3-Pin; LatestRevisionDate: 17-Jul-2002; LatestRevisionNote: Re-released for DXP Platform.; Publisher: Altium Limited
P12 = Header 4: Header, 4-Pin; LatestRevisionDate: 17-Jul-2002; LatestRevisionNote: Re-released for DXP Platform.; Publisher: Altium Limited
P13 = Header 2: VBAT-JACK; LatestRevisionDate: 17-Jul-2002; LatestRevisionNote: Re-released for DXP Platform.; Publisher: Altium Limited
P14 = Header 7: Header, 7-Pin; LatestRevisionDate: 17-Jul-2002; LatestRevisionNote: Re-released for DXP Platform.; Publisher: Altium Limited
P15 = Header 18: FPC-18_0P5; LatestRevisionDate: 17-Jul-2002; LatestRevisionNote: Re-released for DXP Platform.; Publisher: Altium Limited
P16 P18 = Header 22: FPC-22_0P5; LatestRevisionDate: 17-Jul-2002; LatestRevisionNote: Re-released for DXP Platform.; Publisher: Altium Limited
P17 = Header 8: Header, 8-Pin; LatestRevisionDate: 17-Jul-2002; LatestRevisionNote: Re-released for DXP Platform.; Publisher: Altium Limited
PSM1 = PSMPSM: PCA, PSM, PX4, Assembly; Manufacturer 1: 3DR; Mfg Part Num (Alternate): DO NOT SWAP; 3DR_PARTNO: PCA0007; Supplier 1: 3DR; Supplier Unit Price 1: 17; Manufacturer Part Number 1: PCA-0007; Supplier Currency 1: USD; Supplier Order Qty 1: 100
R1 R2 R4 R5 R7-R11 R13 = RESISTOR0402-RES: <b>Resistor</b> / Basic schematic elements and footprints for 0603, 1206, and PTH 1/10th watt (small) resistors.; PARTNO: RC0402FR-07220RL; Supplier 1: Digi-Key
R14 = RESISTOR0402-RES: ResistorBasic schematic elements and footprints for 0603, 1206, and PTH 1/10th watt (small) resistors.; PARTNO: MCR01MZPJ271; Supplier 1: Digi-Key
R15-R26 R28-R34 = RESISTOR0402-RES: ResistorBasic schematic elements and footprints for 0603, 1206, and PTH 1/10th watt (small) resistors.; PARTNO: RMCF0402JT1K00; Supplier 1: Digi-Key
R27 = RESISTOR
S1-S6 = PAD.04: Manufacturer 1: DNF; Supplier Unit Price 1: 0; Supplier 1: DNF; Supplier Part Number 1: DNF
S7 = SWITCH-MOMENTARY-2: Switch; Supplier 1: Farnell
U3 = STM32F407VGT6: ARM Cortex-M4 32-bit MCU+FPU, 210 DMIPS, 1024 kB Flash, 192 kB Internal RAM, 82 I/Os, 100-pin LQFP, -40 to 85 degC, Tray; Manufacturer: STMicroelectronics; D/A Converter: 2x12-bit; FLASH Size (Prog) (kB): 1024; I/Os (High Current): 82; Internal RAM Size (kB): 192; Operating Frequency(F) (Processor speed) (MHz): 168; Supply Voltage(Vcc) max (V): 3.6; Supply Voltage(Vcc) min (V): 1.8; DatasheetVersion: Rev. 4; PackageVersion: Rev. 1, 06/2013; PackageReference: LQFP100; PackageDescription: 100-Pin Low Profile Quad Flat Package, 14 x 14 mm Body, 0.5 mm Pitch; Supplier 1: Digi-Key; Supplier Part Number 1: 497-11605-ND; Supplier 2: Farnell; Supplier Part Number 2: 2064368; Supplier 3: Newark; Supplier Part Number 3: 73T2333; Supplier 4: Mouser; Supplier Part Number 4: 511-STM32F407VGT6; Core: ARM Cortex-M4; Packing: Tray; Mounting Technology: Surface Mount; PartNumber: STM32F407VGT6; ComponentLink1Description: Manufacturer URL; ComponentLink1URL: http://www.st.com/web/en/home.html; ComponentLink2Description: Datasheet; ComponentLink2URL: http://www.st.com/st-web-ui/static/active/en/resource/technical/document/datasheet/DM00037051.pdf; ComponentLink3Description: Package Specification; ComponentLink3URL: http://www.st.com/st-web-ui/static/active/en/resource/technical/document/data_brief/DM00071938.pdf
U$? = MT9V034: PARTNO: MT9V034C12STM; Supplier 1: Digi-Key
X1 = OSCILLATOR-3.2X2.5: CRYSTAL 24MHZ 8PF SMD; 3DR_PARTNO: ECM0708; PARTNO: NX3225SA-24.000MHZ-STD-CSR-1; Supplier 1: Digi-Key; Value: 24MHz